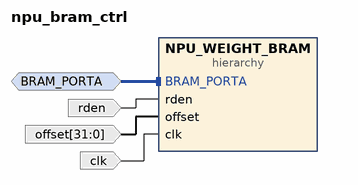
[diagram p0: block diagram of the top level]
# Vivado block design npu_bram_ctrl, xc7z020clg400-1, Vivado 2017.1
create_bd_design npu_bram_ctrl

create_bd_intf_port -mode Slave -vlnv xilinx.com:interface:bram_rtl:1.0 BRAM_PORTA
set_property -dict {CONFIG.MASTER_TYPE BRAM_CTRL} [get_bd_intf_ports BRAM_PORTA]
create_bd_port -dir I rden
create_bd_port -dir I -from 31 -to 0 offset
create_bd_port -dir I clk

create_bd_cell -type hier NPU_WEIGHT_BRAM

# ---- hierarchy /NPU_WEIGHT_BRAM ----
current_bd_instance /NPU_WEIGHT_BRAM
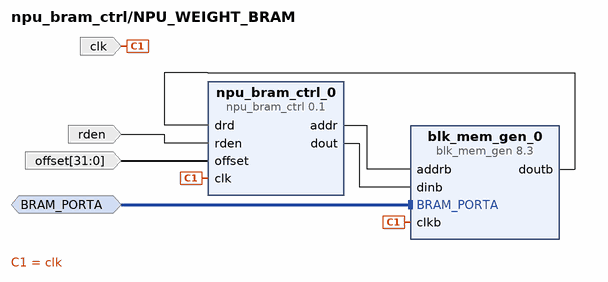
[diagram p1: block diagram inside /NPU_WEIGHT_BRAM]
create_bd_intf_pin -mode Slave -vlnv xilinx.com:interface:bram_rtl:1.0 BRAM_PORTA
create_bd_pin -dir I rden
create_bd_pin -dir I -from 31 -to 0 offset
create_bd_pin -dir I clk

create_bd_cell -type ip -vlnv xilinx.com:ip:blk_mem_gen:8.3 blk_mem_gen_0
set_property -dict [list \
  CONFIG.Memory_Type True_Dual_Port_RAM \
  CONFIG.Enable_B Use_ENB_Pin \
  CONFIG.Use_RSTB_Pin true \
  CONFIG.Port_B_Clock 100 \
  CONFIG.Port_B_Write_Rate 50 \
  CONFIG.Port_B_Enable_Rate 100 \
] [get_bd_cells blk_mem_gen_0]
create_bd_cell -type ip -vlnv xilinx.com:user:npu_bram_ctrl:0.1 npu_bram_ctrl_0

# ---- connections ----

current_bd_instance /NPU_WEIGHT_BRAM
connect_bd_intf_net [get_bd_intf_pins BRAM_PORTA] [get_bd_intf_pins blk_mem_gen_0/BRAM_PORTA]
connect_bd_net [get_bd_pins npu_bram_ctrl_0/addr] [get_bd_pins blk_mem_gen_0/addrb]
connect_bd_net [get_bd_pins blk_mem_gen_0/doutb] [get_bd_pins npu_bram_ctrl_0/drd]
connect_bd_net [get_bd_pins rden] [get_bd_pins npu_bram_ctrl_0/rden]
connect_bd_net [get_bd_pins offset] [get_bd_pins npu_bram_ctrl_0/offset]
connect_bd_net [get_bd_pins clk] [get_bd_pins npu_bram_ctrl_0/clk] [get_bd_pins blk_mem_gen_0/clkb]
connect_bd_net [get_bd_pins npu_bram_ctrl_0/dout] [get_bd_pins blk_mem_gen_0/dinb]

current_bd_instance /
connect_bd_intf_net [get_bd_intf_ports BRAM_PORTA] [get_bd_intf_pins NPU_WEIGHT_BRAM/BRAM_PORTA]
connect_bd_net [get_bd_ports rden] [get_bd_pins NPU_WEIGHT_BRAM/rden]
connect_bd_net [get_bd_ports offset] [get_bd_pins NPU_WEIGHT_BRAM/offset]
connect_bd_net [get_bd_ports clk] [get_bd_pins NPU_WEIGHT_BRAM/clk]

validate_bd_design
save_bd_design
